# Altium schematic sheet [N76E003] Kit.SchDoc
size 193 x 132 mm; PageSetup: Record=PageOptions|CenterHorizontal=True|CenterVertical=True|PrintScale=1.42|XCorrection=1.00|YCorrection=1.00|PrintKind=1|BorderSize=5000000|LeftOffset=0|BottomOffset=0|Orientation=2|PaperLength=2794|PaperWidth=2159|Scale=100|PaperSource=7|PrintQuality=600|MediaType=1|DitherType=10|PrintScaleMode=1|PaperKind=Letter|PaperIndex=1
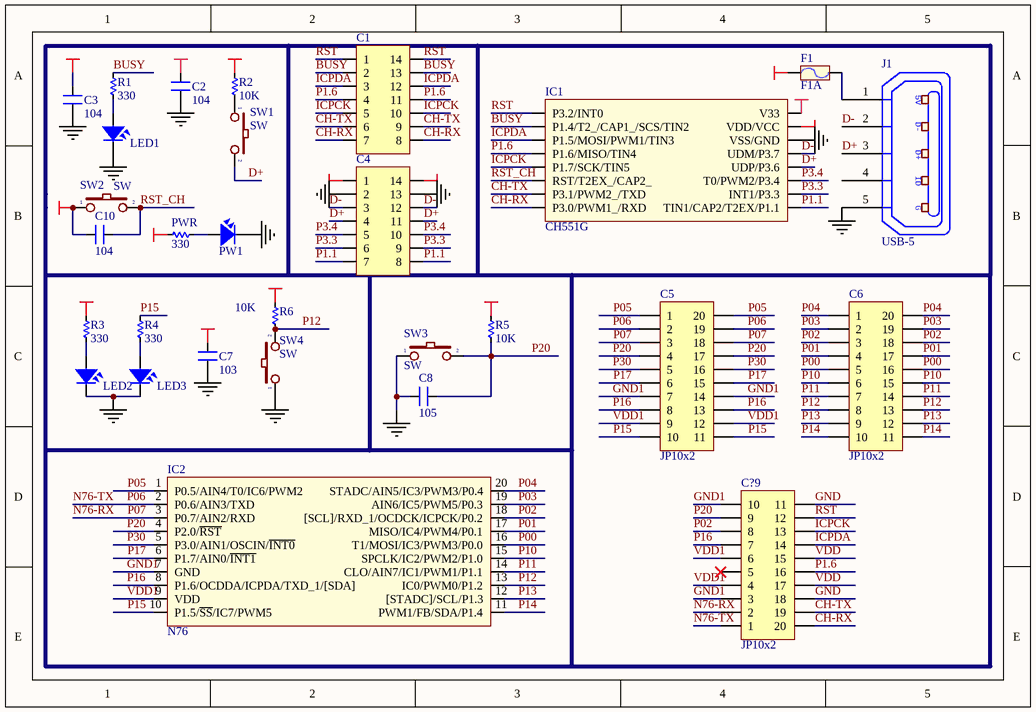
[diagram p0: [N76E003] Kit.SchDoc]

## Parts
C1  JP7x2  [JP7-C2T]  (value not drawn)
C2  104  [CN-SMD-0805]
C3  104  [CN-SMD-0805]
C4  JP7x2  [JP7-C2T]  (value not drawn)
C5  JP10x2  [JP10-C2T]
C6  JP10x2  [JP10-C2T]
C7  103  [CN-SMD-0805]
C8  105  [CN-SMD-0805]
C10  104  [CN-SMD-0805]
C?9  JP10x2  [JP10-D2T]
F1  F1A  [SM-RES-1206]
IC1  CH551G  [SOP16]
IC2  N76  [TSSOP20]
J1  USB-5  [USB-M3]
LED1  LED  [LED-0805-Green]  (value not drawn)
LED2  LED  [LED-0805-Red]  (value not drawn)
LED3  LED  [LED-0805-Blue]  (value not drawn)
PW1  LED  [LED-0805-Green]  (value not drawn)
PWR  330  [RES-SMD-0805]
R1  330  [RES-SMD-0805]
R2  10K  [RES-SMD-0805]
R3  330  [RES-SMD-0805]
R4  330  [RES-SMD-0805]
R5  10K  [RES-SMD-0805]
R6  10K  [RES-SMD-0805]
SW1  SW  [SW1-SMD]
SW2  SW  [SW1-SMD]
SW3  SW  [SW1-SMD]
SW4  SW  [SW1-SMD]

## Nets
+3.3v: C2.2 IC1.16(V33)
GND: C2.1 C3.1 C4.2 C4.13 C?9.11 C?9.18 IC1.14(VSS/GND) J1.5(P5) LED1.2 PW1.2
GND1: C5.7 C5.14 C7.1 C8.2 C?9.3 C?9.10 IC2.7(GND) LED2.2 LED3.2 SW3.1 SW4.1
VDD: C3.2 C4.1 C4.14 C10.2 C?9.15 C?9.17 F1.2 IC1.15(VDD/VCC) PWR.1 R2.1 SW2.1
VDD1: C5.9 C5.12 C7.2 C?9.4 C?9.6 IC2.9(VDD) R3.1 R5.1 R6.1
BUSY: C1.2 C1.13 IC1.2(P1.4/T2_/CAP1_/SCS/TIN2) R1.1
CH-RX: C1.7 C1.8 C?9.20 IC1.8(P3.0/PWM1_/RXD)
CH-TX: C1.6 C1.9 C?9.19 IC1.7(P3.1/PWM2_/TXD)
D+: C4.4 C4.11 IC1.12(UDP/P3.6) J1.3(P3) SW1.2
D-: C4.3 C4.12 IC1.13(UDM/P3.7) J1.2(P2)
ICPCK: C1.5 C1.10 C?9.13 IC1.5(P1.7/SCK/TIN5)
ICPDA: C1.3 C1.12 C?9.14 IC1.3(P1.5/MOSI/PWM1/TIN3)
N76-RX: C5.3 C5.18 C?9.2 IC2.3(P0.7/AIN2/RXD)  [also labelled P07]
N76-TX: C5.2 C5.19 C?9.1 IC2.2(P0.6/AIN3/TXD)  [also labelled P06]
P00: C6.5 C6.16 IC2.16(T1/MOSI/IC3/PWM3/P0.0)
P01: C6.4 C6.17 IC2.17(MISO/IC4/PWM4/P0.1)
P1.1: C4.7 C4.8 IC1.9(TIN1/CAP2/T2EX/P1.1)
P1.6: C1.4 C1.11 C?9.16 IC1.4(P1.6/MISO/TIN4)
P02: C6.3 C6.18 C?9.8 IC2.18([SCL]/RXD_1/OCDCK/ICPCK/P0.2)
P03: C6.2 C6.19 IC2.19(AIN6/IC5/PWM5/P0.3)
P3.3: C4.6 C4.9 IC1.10(INT1/P3.3)
P3.4: C4.5 C4.10 IC1.11(T0/PWM2/P3.4)
P04: C6.1 C6.20 IC2.20(STADC/AIN5/IC3/PWM3/P0.4)
P05: C5.1 C5.20 IC2.1(P0.5/AIN4/T0/IC6/PWM2)
P10: C6.6 C6.15 IC2.15(SPCLK/IC2/PWM2/P1.0)
P11: C6.7 C6.14 IC2.14(CLO/AIN7/IC1/PWM1/P1.1)
P12: C6.8 C6.13 IC2.13(IC0/PWM0/P1.2) R6.2 SW4.2
P13: C6.9 C6.12 IC2.12([STADC]/SCL/P1.3)
P14: C6.10 C6.11 IC2.11(PWM1/FB/SDA/P1.4)
P15: C5.10 C5.11 IC2.10(P1.5/~{SS}/IC7/PWM5) R4.1
P16: C5.8 C5.13 C?9.7 IC2.8(P1.6/OCDDA/ICPDA/TXD_1/[SDA])
P17: C5.6 C5.15 IC2.6(P1.7/AIN0/~{INT1})
P20: C5.4 C5.17 C8.1 C?9.9 IC2.4(P2.0/~{RST}) R5.2 SW3.2
P30: C5.5 C5.16 IC2.5(P3.0/AIN1/OSCIN/~{INT0})
RST: C1.1 C1.14 C?9.12 IC1.1(P3.2/INT0)
RST_CH: C10.1 IC1.6(RST/T2EX_/CAP2_) SW2.2
NetF1_1: F1.1 J1.1(P1)
NetLED1_1: LED1.1 R1.2
NetLED2_1: LED2.1 R3.2
NetLED3_1: LED3.1 R4.2
NetPW1_1: PW1.1 PWR.2
NetR2_2: R2.2 SW1.1

Not connected (* = marked no-connect by the designer): C?9 5*; J1 4(P4)

## Notes on the sheet
- (in symbol USB-5) 5V; D-; D+; ID; G

## Library data of the parts
C1 C4 = JP7x2: WR-PHD 2.54 mm Dual Socket Header; Manufacturer: W¨¹rth Elektronik eiSos GmbH; partNo: 61301421821; ComponentLink1 Description: Manufacturer; ComponentLink2 Description: Datasheet; NoPins: 14; Created Date: 29 March 2013; ComponentLink1URL: http://www.we-online.com; ComponentLink2URL: http://katalog.we-online.de/em/datasheet/6130xx21821.pdf; Created by: Karrer Zheng
C2 C3 C8 C10 = CM: Cap SMD; Value: 103
C5 C6 C?9 = JP10x2: WR-PHD 2.54 mm Dual Socket Header; Manufacturer: W¨¹rth Elektronik eiSos GmbH; partNo: 61302021821; ComponentLink1 Description: Manufacturer; ComponentLink2 Description: Datasheet; NoPins: 20; Created Date: 29 March 2013; ComponentLink1URL: http://www.we-online.com; ComponentLink2URL: http://katalog.we-online.de/em/datasheet/6130xx21821.pdf; Created by: Karrer Zheng
C7 = CM: Cap SMD; Value: 103
F1 = Fuse: Designed by: VanDungEvn; Value: Fuse
IC1 = [MCU] CH551G: MCU: 8051 (1T); clock: Internal oscillator 24MHz; Flash: 10KB; Ram: 256 byte; XRAM: 512 byte; Timer: 3; PWM: 2; UART: 1; Touch: 4; USB: 1 (Full Speed); SPI: 1
IC2 = [MCU] N76E003: Core  - 1T 8051 processor  - Max frequency up to16 MHz  - Wide operating voltage: 2.4V to 5.5V  - Temperature range: -40℃ to 105℃    Memory  - 18 KB of Flash memory  - 1 KB of SRAM  - Supports configurable Data Flash  - Supports program update by:    ISP (In-System Programming)  ICP (In-Circuit Programming)  IAP (In-Application Programming)  PWM  - Up to 6-ch PWM  - Programmable dead-zone generator    ADC  - 12-bit 8-ch ADC  - Runs up to 500 kSPS    Connectivity  - Two UARTs up to 115200 bps  - One SPI up to 8 MHz  - One I²C up to 400 kHz    Clock Control  - < 2% deviation16 MHz Internal RC oscillator  - 10 kHz Internal RC oscillator
J1 = USB-5: Manufacturer: FCI; Manufacturer Part Number: 10118193-0001LF; Connector Type: USB - micro B; Number of Contacts: 5; Gender: Receptacle; Specifications: USB 2.0; .Creator: MM; .Checked PCB: RF; Supplier 1: Digi-Key; RoHS: RoHS Compliant; Category: Connectors, Interconnects; Stock 1: 28642; Pricing 1: 1=0.46, 10=0.433, 25=0.3712, 50=0.3156, 100=0.3032, 250=0.27224, 500=0.25988 (USD); Packaging: Cut Tape (CT); Mounting Type: Surface Mount, Right Angle, Horizontal; Features: Shielded, Solder Retention; Ingress Protection: -; ComponentLink1URL: http://portal.fciconnect.com/Comergent//fci/drawing/10118193.pdf; ComponentLink1Description: http://portal.fciconnect.com/Comergent//fci/drawing/10118193.pdf; Supplier Part Number 1: 609-4616-1-ND; .Checked SCH: MM
LED1-LED3 PW1 = LED SMD: Value: LED 3 - 5 ly 2 Colour
PWR R1-R6 = Res-SMD: Resistor; Manufacturer: Generic Components; Class: Passive; Published: 08/06/2000; Publisher: Altium Hobart Technology Centre
SW1-SW4 = SW2: Switch button 2 pin; Value: SW chip 2 pin